# Altium schematic sheet pga.SchDoc
size A3; SheetNumber: 4; SheetTotal: 12
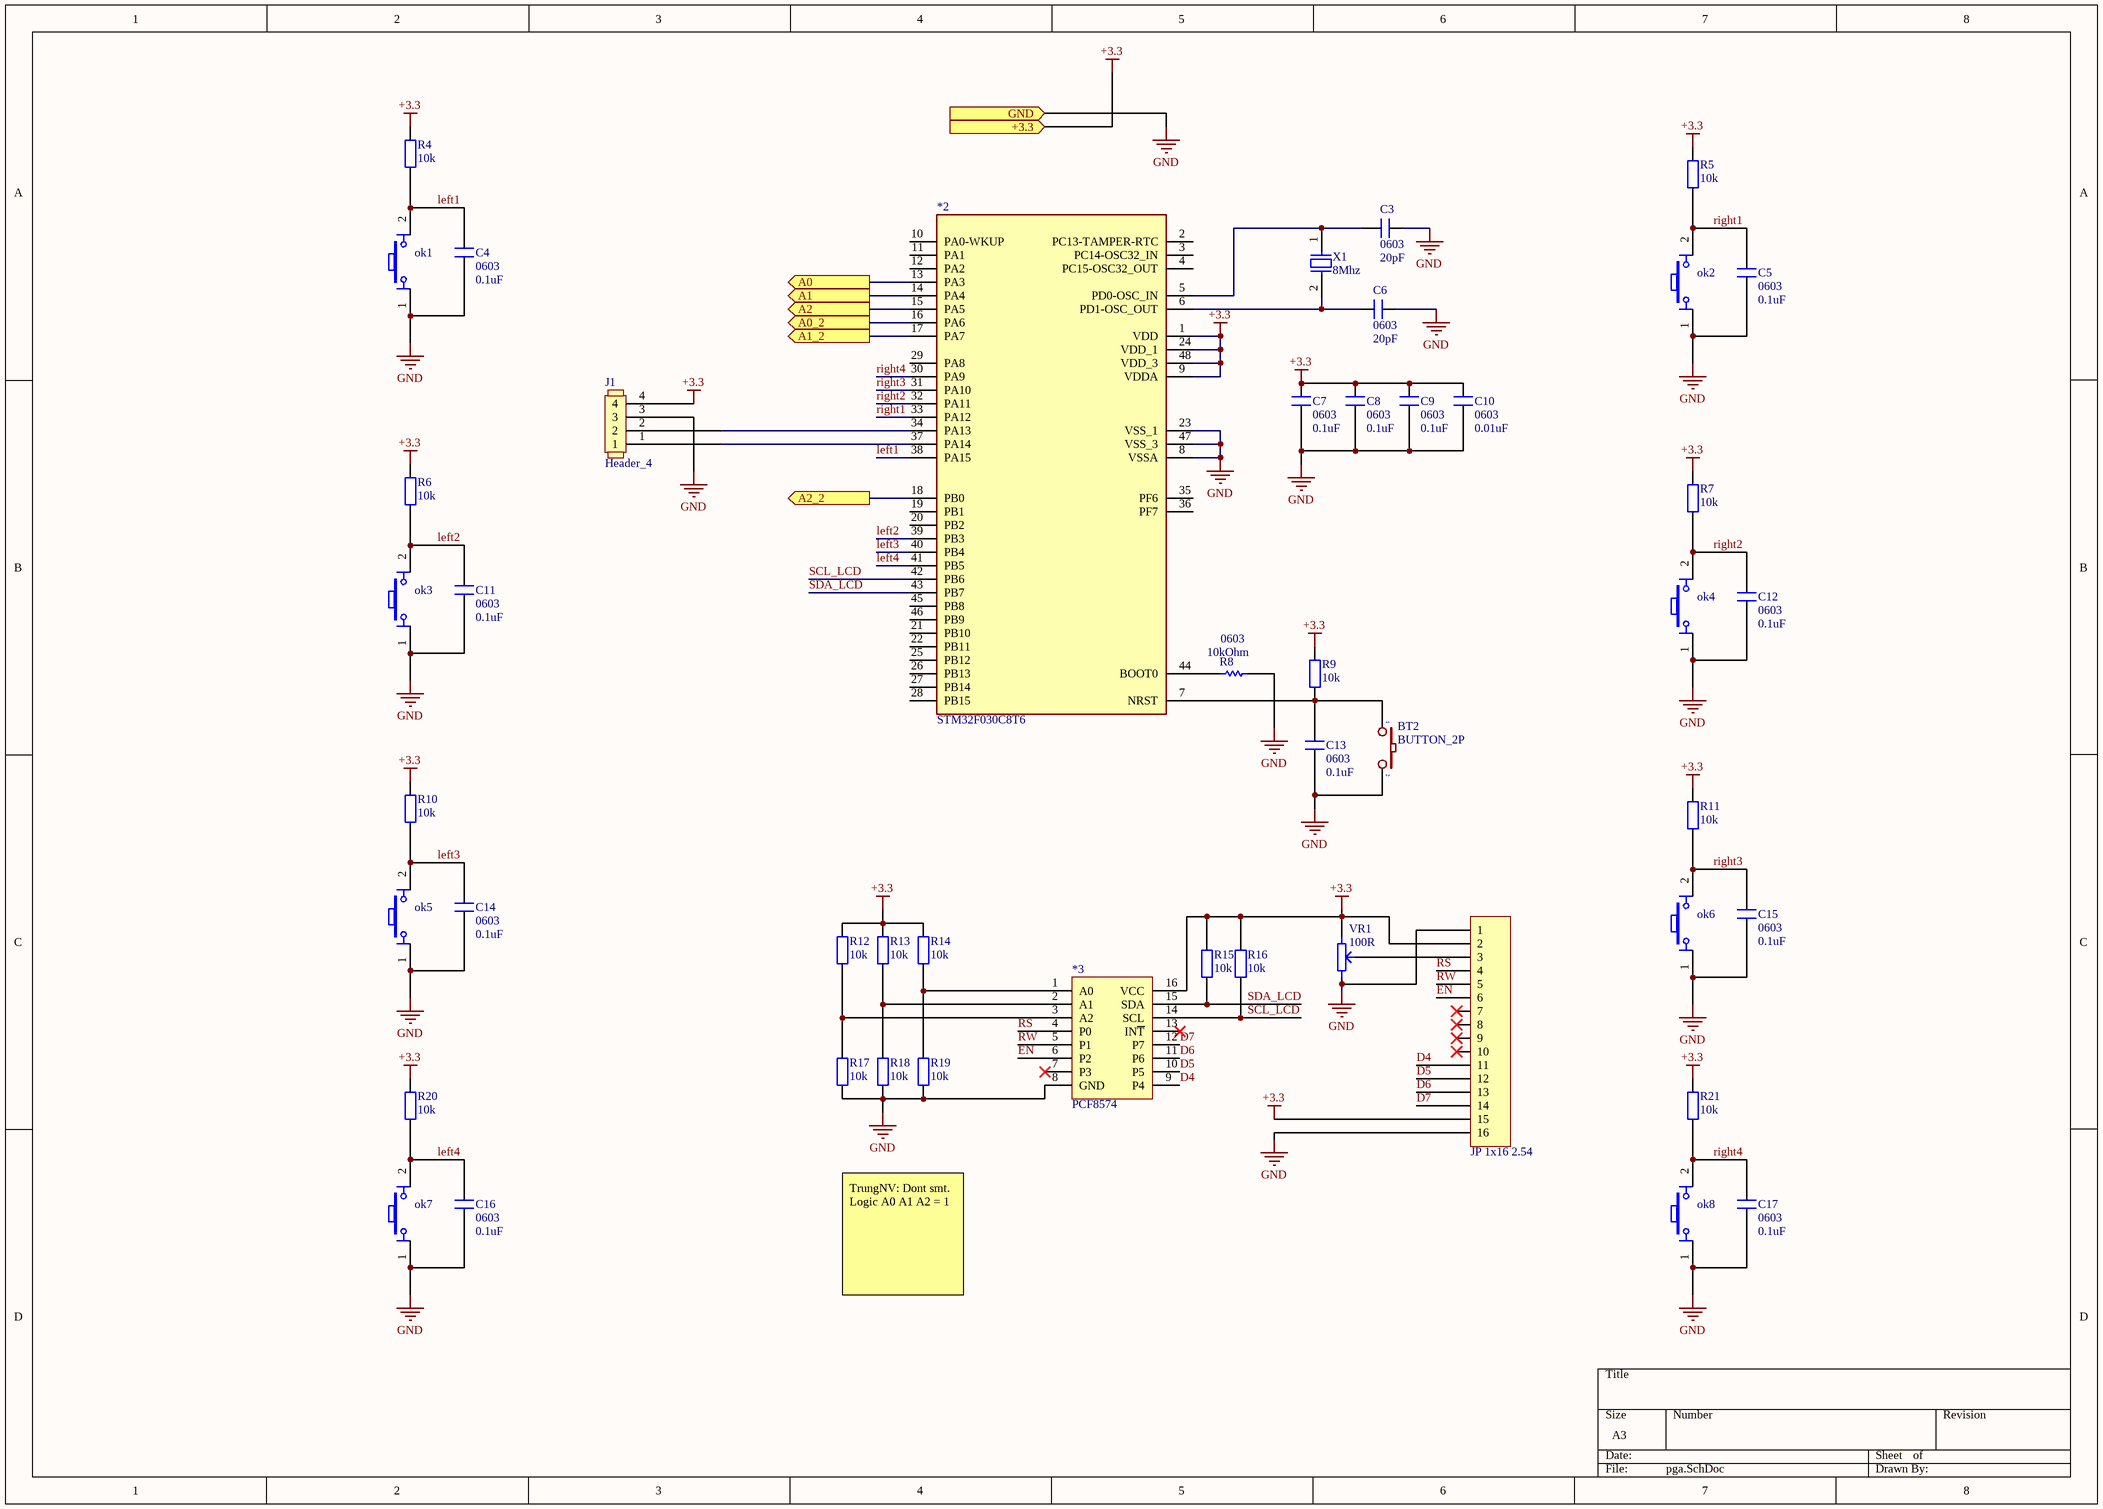
[diagram p0: pga.SchDoc]

## Parts
*2  STM32F030C8T6  [STM32_LQPF48]
*3  PCF8574  [SOIC 16]
BT2  BUTTON_2P  [BUTTON_2P_SMD]
C3  0603  value 20pF  [C_0603]
C4  0603  value 0.1uF  [C_0603]
C5  0603  value 0.1uF  [C_0603]
C6  0603  value 20pF  [C_0603]
C7  0603  value 0.1uF  [C_0603]
C8  0603  value 0.1uF  [C_0603]
C9  0603  value 0.1uF  [C_0603]
C10  0603  value 0.01uF  [C_0603]
C11  0603  value 0.1uF  [C_0603]
C12  0603  value 0.1uF  [C_0603]
C13  0603  value 0.1uF  [C_0603]
C14  0603  value 0.1uF  [C_0603]
C15  0603  value 0.1uF  [C_0603]
C16  0603  value 0.1uF  [C_0603]
C17  0603  value 0.1uF  [C_0603]
J1  Header_4  [HEADER_4_2P54_SHROUDED]
JP2  JP 1x16 2.54  [JP 1X16 DT]
ok1  Nut Nhan 4 Chan Cam 6x6  [Nut Nhan 4 Chan Cam 6x6]  (value not drawn)
ok2  Nut Nhan 4 Chan Cam 6x6  [Nut Nhan 4 Chan Cam 6x6]  (value not drawn)
ok3  Nut Nhan 4 Chan Cam 6x6  [Nut Nhan 4 Chan Cam 6x6]  (value not drawn)
ok4  Nut Nhan 4 Chan Cam 6x6  [Nut Nhan 4 Chan Cam 6x6]  (value not drawn)
ok5  Nut Nhan 4 Chan Cam 6x6  [Nut Nhan 4 Chan Cam 6x6]  (value not drawn)
ok6  Nut Nhan 4 Chan Cam 6x6  [Nut Nhan 4 Chan Cam 6x6]  (value not drawn)
ok7  Nut Nhan 4 Chan Cam 6x6  [Nut Nhan 4 Chan Cam 6x6]  (value not drawn)
ok8  Nut Nhan 4 Chan Cam 6x6  [Nut Nhan 4 Chan Cam 6x6]  (value not drawn)
R4  10k  [tro smd 0805]
R5  10k  [tro smd 0805]
R6  10k  [tro smd 0805]
R7  10k  [tro smd 0805]
R8  0603  value 10kOhm  [R_0603]
R9  10k  [tro smd 0805]
R10  10k  [tro smd 0805]
R11  10k  [tro smd 0805]
R12  10k  [tro smd 0805]
R13  10k  [tro smd 0805]
R14  10k  [tro smd 0805]
R15  10k  [tro smd 0805]
R16  10k  [tro smd 0805]
R17  10k  [tro smd 0805]
R18  10k  [tro smd 0805]
R19  10k  [tro smd 0805]
R20  10k  [tro smd 0805]
R21  10k  [tro smd 0805]
VR1  100R  [Bien Tro Tam Giac Dung]
X1  8Mhz  [XTAL_SMD_3P5]

## Ports
+3.3 (in), A0 (out), A0_2 (out), A1 (out), A1_2 (out), A2 (out), A2_2 (out), GND (in)

## Nets
+3.3: *2.1(VDD) *2.9(VDDA) *2.24(VDD_1) *2.48(VDD_3) *3.16(VCC) C7.2 C8.2 C9.2 C10.2 J1.4 JP2.2 JP2.15 R4.2 R5.2 R6.2 R7.2 R9.2 R10.2 R11.2 R12.2 R13.2 R14.2 R15.2 R16.2 R20.2 R21.2 VR1.1 ; port +3.3
GND: *2.8(VSSA) *2.23(VSS_1) *2.47(VSS_3) *3.8(GND) BT2.2 C3.2 C4.1 C5.1 C6.2 C7.1 C8.1 C9.1 C10.1 C11.1 C12.1 C13.1 C14.1 C15.1 C16.1 C17.1 J1.3 JP2.1 JP2.16 ok1.1 ok2.1 ok3.1 ok4.1 ok5.1 ok6.1 ok7.1 ok8.1 R8.2 R17.1 R18.1 R19.1 VR1.3 ; port GND
A0: *2.13(PA3) ; port A0
A0_2: *2.16(PA6) ; port A0_2
A1: *2.14(PA4) ; port A1
A1_2: *2.17(PA7) ; port A1_2
A2: *2.15(PA5) ; port A2
A2_2: *2.18(PB0) ; port A2_2
D4: *3.9(P4) JP2.11
D5: *3.10(P5) JP2.12
D6: *3.11(P6) JP2.13
D7: *3.12(P7) JP2.14
EN: *3.6(P2) JP2.6
left1: *2.38(PA15) C4.2 ok1.2 R4.1
left2: *2.39(PB3) C11.2 ok3.2 R6.1
left3: *2.40(PB4) C14.2 ok5.2 R10.1
left4: *2.41(PB5) C16.2 ok7.2 R20.1
right1: *2.33(PA12) C5.2 ok2.2 R5.1
right2: *2.32(PA11) C12.2 ok4.2 R7.1
right3: *2.31(PA10) C15.2 ok6.2 R11.1
right4: *2.30(PA9) C17.2 ok8.2 R21.1
RS: *3.4(P0) JP2.4
RW: *3.5(P1) JP2.5
SCL_LCD: *2.42(PB6) *3.14(SCL) R16.1
SDA_LCD: *2.43(PB7) *3.15(SDA) R15.1
Net*2_5: *2.5(PD0-OSC_IN) C3.1 X1.1
Net*2_6: *2.6(PD1-OSC_OUT) C6.1 X1.2
Net*2_7: *2.7(NRST) BT2.1 C13.2 R9.1
Net*2_34: *2.34(PA13) J1.2
Net*2_37: *2.37(PA14) J1.1
Net*2_44: *2.44(BOOT0) R8.1
Net*3_1: *3.1(A0) R14.1 R19.2
Net*3_2: *3.2(A1) R13.1 R18.2
Net*3_3: *3.3(A2) R12.1 R17.2
NetJP2_3: JP2.3 VR1.2

Not connected (* = marked no-connect by the designer): *2 2(PC13-TAMPER-RTC) 3(PC14-OSC32_IN) 4(PC15-OSC32_OUT) 10(PA0-WKUP) 11(PA1) 12(PA2) 19(PB1) 20(PB2) 21(PB10) 22(PB11) 25(PB12) 26(PB13) 27(PB14) 28(PB15) 29(PA8) 35(PF6) 36(PF7) 45(PB8) 46(PB9); *3 7(P3)* 13(IN~{T})*; JP2 7* 8* 9* 10*

## Notes on the sheet
- TrungNV: Dont smt. Logic A0 A1 A2 = 1

## Library data of the parts
BT2 = BUTTON_2P: Manufacturer: C&K; Part Number: PTS636 SM25F SMTR LFS; Part Code: S2000-000001; Point: 2; Value: BUTTON_2P; Description SEL: BUTTON_2P; Footprint Type: TH
C3 = Cap_Cer_0603_18pF: Ceramic Capacitor 0603  (+-10% TH)/(+10%SMD); Manufacturer: Murata Electronics; Part Number: GRM1885C1H180JA01J; Part Code: S1200-000093; Description SEL: CAP CER 18PF 50V C0G/NP0 0603; Point: 2; Footprint Type: SMD
C4 C5 C11 C12 C14-C17 = Cap_Cer_0603_0.1uF_50V: Ceramic Capacitor 0603  (+-10% TH)/(+10%SMD); Manufacturer: Murata Electronics; Part Number: GRM188R71H104KA93D; Part Code: S1200-000078; Description SEL: CAP CER 0.1UF 50V X7R 0603; Point: 2; Footprint Type: SMD
C6-C10 C13 = Cap_Cer_0603_0.1uF_25V: Ceramic Capacitor 0603  (+-10% TH)/(+10%SMD); Manufacturer: Murata Electronics; Part Number: GCM188R91E104KA37J; Part Code: S1200-000077; Description SEL: CAP CER 0.1UF 25V X8R 0603; Point: 2; Footprint Type: SMD
J1 = Header_4: Part Code: S1900-000023; Point: 4; Manufacturer: *; Part Number: *; Value: *; Description SEL: Header_4; Footprint Type: TH
JP2 = JP 1x16 2.54 Duc Thang: Cắm; Ten_Linh_Kien: Jump Đơn Đực 2.54MM 1x40P Thẳng 11MM; Don_Vi: Con; Ma_Hang: MH000903; Ghi_Chu: *; Kieu_Chan: *; Chung_Loai: Cắm
ok1-ok8 = Nut Nhan 4 Chan Cam 6x6: Nut Nhan 4 Chan 6x6mm; Ten: Nút Nhấn 4 Chân 6x6x5MM DIP; Ma_Hang: MH004584
R4-R7 R9-R21 = Tro 0805 1% 10k: Dán; Don_Vi: Con; So_Chan: 2; Ten_Linh_Kien: Trở 0805 1% 10k; Ma_Hang: MH005473; Chung_Loai: Dán; Kieu_Chan: *
R8 = Resistor_0603_10kOhm 1%: RES 10K OHM 1% 1/10W 0603; Manufacturer: YAGEO; Part Number: RC0603FR-7W10KL; Part Code: S1100-000043; Point: 2; Description SEL: RES 10K OHM 1% 1/10W 0603; Footprint Type: SMD; Power: 1/10W; Tolerance: 1%
VR1 = Bien tro tam giac 100R Dung: Cắm; Ten_Linh_Kien: Biến Trở Tam Giác 101-100R RM065; Don_Vi: Con; Ma_Hang: MH003710; Ghi_Chu: *; Kieu_Chan: *; Chung_Loai: Cắm
X1 = Xtal_2P_SMD_5P0X3P5_8Mhz: Use for 8Mhz; Manufacturer: WTL; Part Number: WTL5G11651; Part Code: S1600-000001; Description SEL: CRYSTAL 8.0000MHZ SURFACE MOUNT; Point: 2; Value: 8Mhz; Footprint Type: SMD